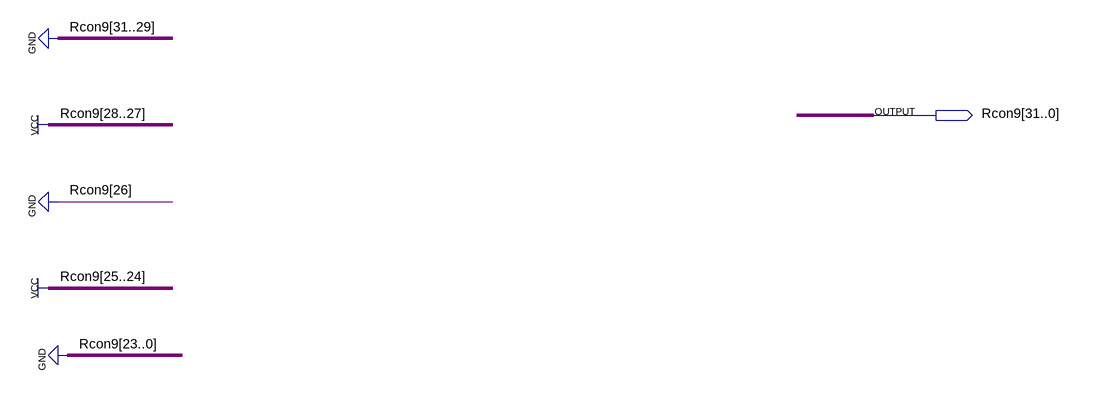
[diagram p0: schematic sheet]
// Quartus schematic Rcon9.bdf as structural Verilog: 0 symbols, 1 pins
module Rcon9 (
  output [31:0] Rcon9
);


  assign Rcon9 = 32'b00011011000000000000000000000000;
endmodule
